# Altium schematic sheet ESP32.SchDoc
size B
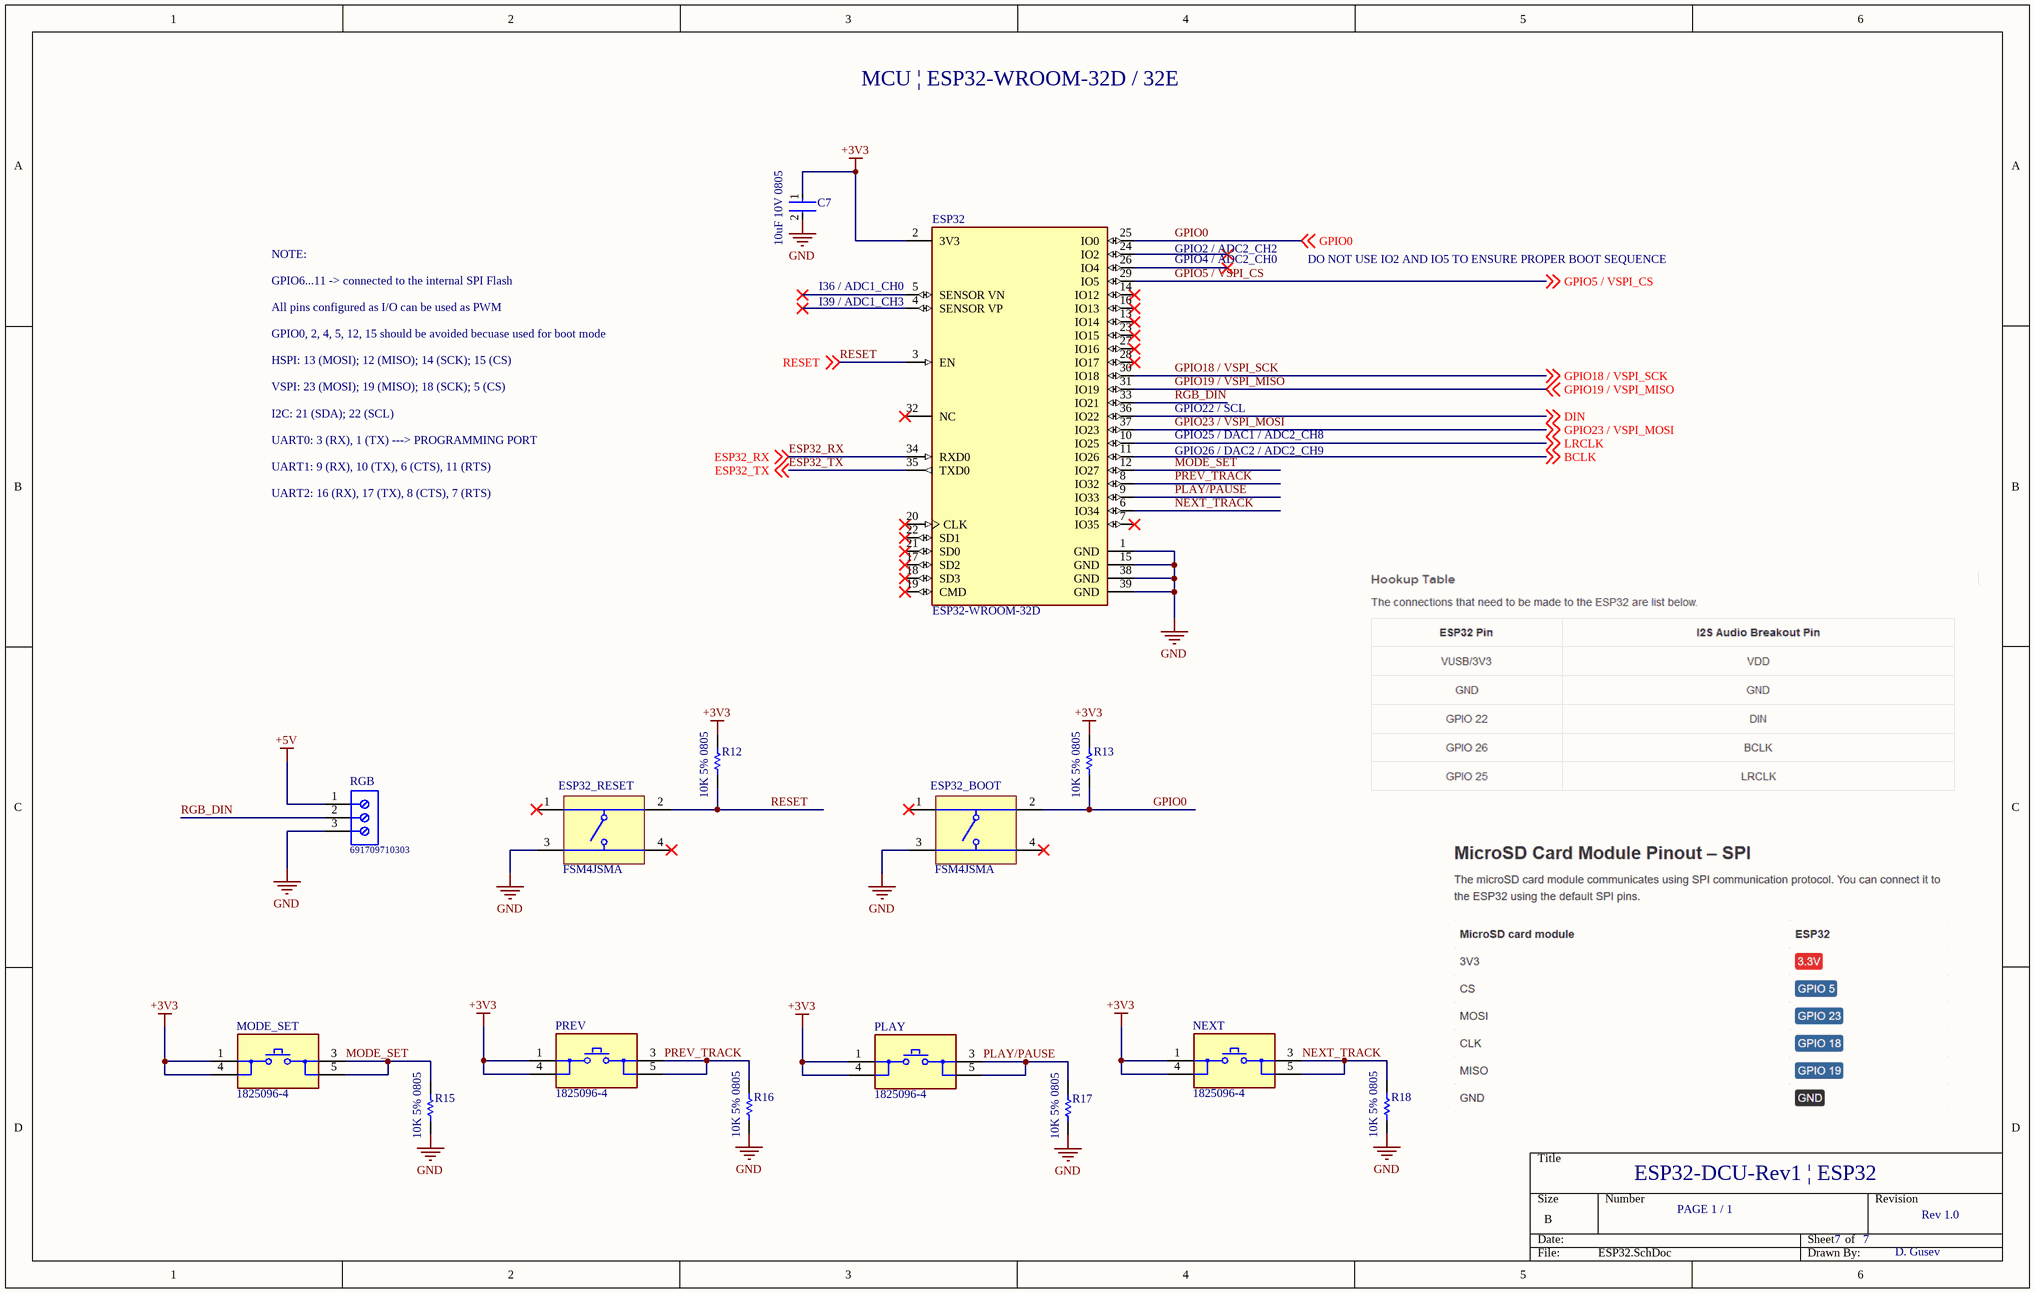
[diagram p0: ESP32.SchDoc]

## Parts
C7  10uF 10V 0805  [FP-C0805C-DG-MFG]
ESP32  ESP32-WROOM-32D  [FP-ESP32-WROOM-32D-MFG]
ESP32_BOOT  FSM4JSMA  [TECO-FSM4JSMA_V]
ESP32_RESET  FSM4JSMA  [TECO-FSM4JSMA_V]
MODE_SET  1825096-4  [FP-1825096-4-MFG]
NEXT  1825096-4  [FP-1825096-4-MFG]
PLAY  1825096-4  [FP-1825096-4-MFG]
PREV  1825096-4  [FP-1825096-4-MFG]
R12  10K 5% 0805  [RESC2013X60X40ML20T25]
R13  10K 5% 0805  [RESC2013X60X40ML20T25]
R15  10K 5% 0805  [RESC2013X60X40ML20T25]
R16  10K 5% 0805  [RESC2013X60X40ML20T25]
R17  10K 5% 0805  [RESC2013X60X40ML20T25]
R18  10K 5% 0805  [RESC2013X60X40ML20T25]
RGB  691709710303  [691709710303]

## Nets
+3V3: C7.1 ESP32.2(3V3) MODE_SET.1 MODE_SET.4 NEXT.1 NEXT.4 PLAY.1 PLAY.4 PREV.1 PREV.4 R12.2 R13.2
+5V: RGB.1
GND: C7.2 ESP32.1(GND) ESP32.15(GND) ESP32.38(GND) ESP32.39(GND) ESP32_BOOT.3 ESP32_RESET.3 R15.1 R16.1 R17.1 R18.1 RGB.3
BCLK: ESP32.11(IO26) ; off-sheet BCLK
DIN: ESP32.36(IO22) ; off-sheet DIN
ESP32_RX: ESP32.34(RXD0) ; off-sheet ESP32_RX
ESP32_TX: ESP32.35(TXD0) ; off-sheet ESP32_TX
GPIO0: ESP32.25(IO0) ESP32_BOOT.2 R13.1 ; off-sheet GPIO0
GPIO5 / VSPI_CS: ESP32.29(IO5) ; off-sheet GPIO5 / VSPI_CS
GPIO18 / VSPI_SCK: ESP32.30(IO18) ; off-sheet GPIO18 / VSPI_SCK
GPIO19 / VSPI_MISO: ESP32.31(IO19) ; off-sheet GPIO19 / VSPI_MISO
GPIO23 / VSPI_MOSI: ESP32.37(IO23) ; off-sheet GPIO23 / VSPI_MOSI
LRCLK: ESP32.10(IO25) ; off-sheet LRCLK
MODE_SET: ESP32.12(IO27) MODE_SET.3 MODE_SET.5 R15.2
NEXT_TRACK: ESP32.6(IO34) NEXT.3 NEXT.5 R18.2
PLAY/PAUSE: ESP32.9(IO33) PLAY.3 PLAY.5 R17.2
PREV_TRACK: ESP32.8(IO32) PREV.3 PREV.5 R16.2
RESET: ESP32.3(EN) ESP32_RESET.2 R12.1 ; off-sheet RESET
RGB_DIN: ESP32.33(IO21) RGB.2

Not connected (* = marked no-connect by the designer): ESP32 4(SENSOR_VP)* 5(SENSOR_VN)* 7(IO35)* 13(IO14)* 14(IO12)* 16(IO13)* 17(SD2)* 18(SD3)* 19(CMD)* 20(CLK)* 21(SD0)* 22(SD1)* 23(IO15)* 24(IO2)* 26(IO4)* 27(IO16)* 28(IO17)* 32(NC)*; ESP32_BOOT 1* 4*; ESP32_RESET 1* 4*

## Notes on the sheet
- MCU | ESP32-WROOM-32D / 32E
- NOTE:
- GPIO6...11 -> connected to the internal SPI Flash
- (near ESP32) I36 / ADC1_CH0
- GPIO2 / ADC2_CH2
- GPIO4 / ADC2_CH0
- DO NOT USE IO2 AND IO5 TO ENSURE PROPER BOOT SEQUENCE
- All pins configured as I/O can be used as PWM
- GPIO0, 2, 4, 5, 12, 15 should be avoided becuase used for boot mode
- HSPI: 13 (MOSI); 12 (MISO); 14 (SCK); 15 (CS)
- (near ESP32) I39 / ADC1_CH3
- VSPI: 23 (MOSI); 19 (MISO); 18 (SCK); 5 (CS)
- I2C: 21 (SDA); 22 (SCL)
- GPIO22 / SCL
- GPIO25 / DAC1 / ADC2_CH8
- UART0: 3 (RX), 1 (TX) ---> PROGRAMMING PORT
- UART1: 9 (RX), 10 (TX), 6 (CTS), 11 (RTS)
- UART2: 16 (RX), 17 (TX), 8 (CTS), 7 (RTS)
- GPIO26 / DAC2 / ADC2_CH9
- ESP32-DCU-Rev1 | ESP32
- PAGE 1 / 1
- 7
- Rev 1.0
- D. Gusev

## Library data of the parts
C7 = CMP-2007-03243-2: CAP CER 10UF 10V X5R 0805; Manufacturer Part Number: C0805C106K8PACTU; Manufacturer: Kemet; 3DS Part Number: 220-00001; Tolerance: 10%; Temperature Coefficient: 15%; Material: Ceramic; Device Class L2: Capacitors; Device Class L1: Passive Components; ComponentLink2URL: https://content.kemet.com/datasheets/KEM_C1006_X5R_SMD.pdf; Height: 1.4mm; Lead Free: Yes; Digikey Description: CAP CER 10UF 10V X5R 0805; Octopart: https://octopart.com/c0805c106k8pactu-kemet-98697; Capacitance: 10uF; Value: 10uF; Temperature Range Low: -55°C; Temperature: -55°C to +85°C; Automotive: No; Mouser Description: CAP CER 10UF 10V X5R 0805; Ipc Land Pattern Name: CAPC200125X125; Temperature Range High: +85°C; Voltage: 10V; RoHS: TRUE; Device Class L3: Ceramic Capacitors; ComponentLink2Description: Datasheet; Voltage Rating: 10V; Package: C0805C-DG; Temperature Characteristic: X5R; Category: Cap
ESP32 = CMP-194065-000003-1: WIFI MODULE 32MBITS SPI FLASH; Manufacturer: Espressif Systems; Max Supply Voltage: 3.6V; Nominal Supply Current: 500mA; Max Frequency: 2484MHz; Number Of Adc Channels: 16; Number Of Gpio: 32; Interface: I2C,SPI,UART,Ethernet,I2S,Other; Data Rate: 150Mbits/s; Min Supply Voltage: 3V; Bandwidth: 72MHz; Sensitivity: -98dBm; Octopart: https://octopart.com/esp32-wroom-32d-espressif+systems-91040050; Package: ESP32-WROOM-32D; ComponentLink2URL: https://www.espressif.com/sites/default/files/documentation/esp32-wroom-32d_esp32-wroom-32u_datasheet_en.pdf; Lead Free: Yes; Category: UNK; Mouser Description: Wi-Fi/BT BLE Module ESP32-D0WD, SPI Flash, UART, P; Device Class L1: Integrated Circuits (ICs); RoHS: TRUE; Temperature Range Low: -40°C; ComponentLink2Description: Datasheet; Digikey Description: WIFI MODULE 32MBITS SPI FLASH; Height: 3.2mm; Temperature: -40°C to +85°C; Manufacturer Part Number: ESP32-WROOM-32D; Device Class L3: Transceivers; Device Class L2: RF Semiconductors and Devices; Temperature Range High: +85°C; Automotive: No
ESP32_BOOT ESP32_RESET = CMP-2000-05602-2: Swicth, SPST, 24 V, -35 to 85 degC, 4-Pin SMD, RoHS, Tape and Reel; Manufacturer: TE Connectivity; Switch Travel: 0.25mm; Mechanical Life: 100000Cycles; Contact Current Rating: 50mA; Operating Force: 1.57N; Actuator Material: Polyamide; Contact Resistance: 100mOhm; Voltage Rating: 24V; Illumination Type: Illuminated; Actuator Length: 0.055inch; Max Voltage Rating (DC): 12V; Case\/Package: SMD/SMT; Orientation: Straight; Datasheet URL: http://www.te.com/commerce/DocumentDelivery/DDEController?Action=showdoc&DocId=Customer+Drawing%7F2-1437565-7%7FV%7Fpdf%7FEnglish%7FENG_CD_2-1437565-7_V.pdf%7F4-1437565-2; Min Operating Temperature: -35degC; Packaging: LoosePiece; Termination: GullWing; Throw Configuration: SPST; Package Description: 4-Pin Surface Mount Device, Body 6 x 6 mm, Pitch 4.5 mm; Mounting Technology: SurfaceMount; Contact Plating: Silver; Datasheet Version: Rev. V, 02/2015; RoHSCompliant: true; Max Operating Temperature: 85degC; Length: 6mm; Voltage Rating (DC): 24V; Electrical Life: 100000Cycles; Current Rating: 50mA; Package Quantity: 750; Mount: SurfaceMount; Package Reference: FSM4JSMA; Manufacturer URL: http://www.te.com/; Width: 6mm; REACH SVHC: Unknown; Contact Material: CopperAlloy
MODE_SET NEXT PLAY PREV = CMP-03402-000007-1: SWITCH PUSH SPST-NO 0.4VA 20V; Switch Function: Off-Mom; Actuator Material: Thermoplastic; Operating Force: 3.92N; Throw Configuration: SPST; Contact Resistance: 20mR; Illumination Type: Illuminated; Contact Current Rating: 400mA; Actuator Color: Black; Electrical Life: 100000Cycles; Actuator Length: 3.84mm; Mount: Through Hole; Contact Plating: Gold; Max Voltage Rating (AC): 20V; Length: 8.13mm; Voltage Rating (AC): 20V; Series: TP, Alcoswitch; Orientation: Right Angle; Voltage Rating (DC): 20V; Max Voltage Rating (DC): 20V; RoHS Compliant: Yes; Termination: PC Pins; Min Operating Temperature: -30°C; Contact Material: Copper Alloy; Package Quantity: 25; Packaging: Bulk; Type: Switch; Depth: 12.9mm; Max Operating Temperature: 65°C; Illumination Color: Black
R12 R13 R15-R18 = CMP-2001-00590-1: Part Number: ERA6AEB123V; Manufacturer: Panasonic
RGB = CMP-1502-03336-1: Serie 7097 - 5.00 mm Horizontal Entry SMT with Pressure Clamp WR-TBL, 3 pin; Manufacturer: Wurth Elektronik; Pitch: 5.00mm; Pin Number: 3; Mounting Technology: SMT; Publisher: WurthElektronik; Package Reference: 691709710303; Packaging: TapeandReelwithCap; Part Number: 691709710303; Operating Temperature: -45to130degC; Datasheet URL: http://katalog.we-online.de/em/datasheet/6917097103xx.pdf; Manufacturer URL: http://www.we-online.de